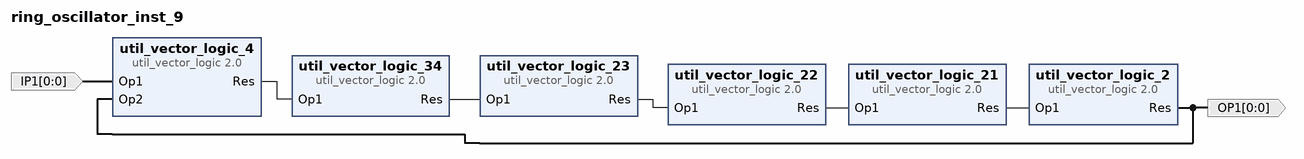
[diagram p0: block diagram of the top level]
# Vivado block design ring_oscillator_inst_9, xc7z020clg400-1, Vivado 2021.1
create_bd_design ring_oscillator_inst_9

create_bd_port -dir O -from 0 -to 0 OP1
create_bd_port -dir I -from 0 -to 0 IP1

create_bd_cell -type ip -vlnv xilinx.com:ip:util_vector_logic:2.0 util_vector_logic_4
set_property -dict {CONFIG.C_OPERATION and CONFIG.C_SIZE 1} [get_bd_cells util_vector_logic_4]
create_bd_cell -type ip -vlnv xilinx.com:ip:util_vector_logic:2.0 util_vector_logic_2
set_property -dict {CONFIG.C_OPERATION not CONFIG.C_SIZE 1} [get_bd_cells util_vector_logic_2]
create_bd_cell -type ip -vlnv xilinx.com:ip:util_vector_logic:2.0 util_vector_logic_21
set_property -dict {CONFIG.C_OPERATION not CONFIG.C_SIZE 1} [get_bd_cells util_vector_logic_21]
create_bd_cell -type ip -vlnv xilinx.com:ip:util_vector_logic:2.0 util_vector_logic_22
set_property -dict {CONFIG.C_OPERATION not CONFIG.C_SIZE 1} [get_bd_cells util_vector_logic_22]
create_bd_cell -type ip -vlnv xilinx.com:ip:util_vector_logic:2.0 util_vector_logic_23
set_property -dict {CONFIG.C_OPERATION not CONFIG.C_SIZE 1} [get_bd_cells util_vector_logic_23]
create_bd_cell -type ip -vlnv xilinx.com:ip:util_vector_logic:2.0 util_vector_logic_34
set_property -dict {CONFIG.C_OPERATION not CONFIG.C_SIZE 1} [get_bd_cells util_vector_logic_34]

# ---- connections ----

connect_bd_net -net Op1_0_1 [get_bd_ports IP1] [get_bd_pins util_vector_logic_4/Op1]
connect_bd_net [get_bd_pins util_vector_logic_21/Res] [get_bd_pins util_vector_logic_2/Op1]
connect_bd_net [get_bd_pins util_vector_logic_22/Res] [get_bd_pins util_vector_logic_21/Op1]
connect_bd_net [get_bd_pins util_vector_logic_23/Res] [get_bd_pins util_vector_logic_22/Op1]
connect_bd_net [get_bd_pins util_vector_logic_2/Res] [get_bd_ports OP1] [get_bd_pins util_vector_logic_4/Op2]
connect_bd_net [get_bd_pins util_vector_logic_34/Res] [get_bd_pins util_vector_logic_23/Op1]
connect_bd_net [get_bd_pins util_vector_logic_4/Res] [get_bd_pins util_vector_logic_34/Op1]

validate_bd_design
save_bd_design
